# EAGLE design duinolpcfwhspi (EAGLE 7.2.0)
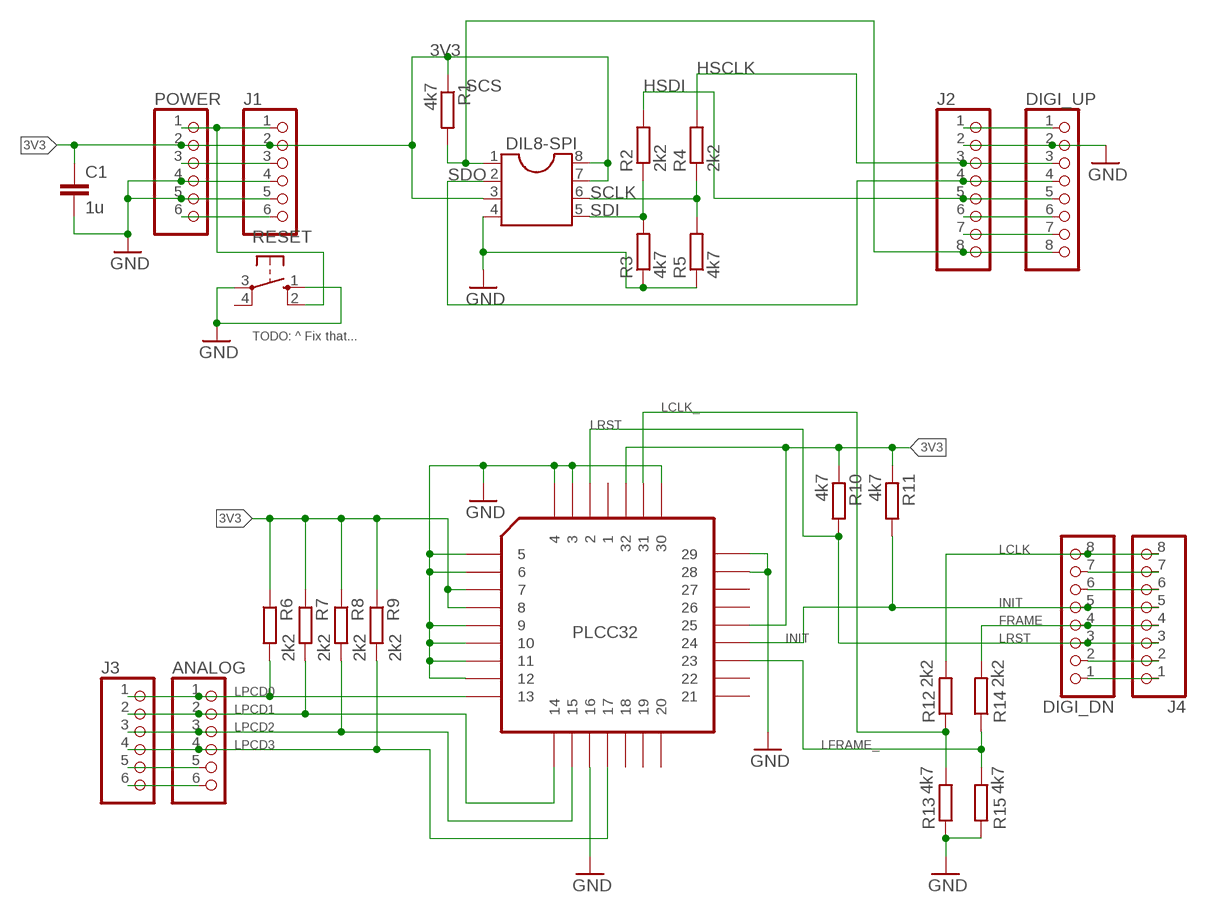
[diagram p0: schematic, sheet 1]

## Parts
ANALOG  PINHD-1X6  [1X06]
C1  1u  C-EU025-025X050  [C025-025X050]
DIGI_DN  PINHD-1X8TH  [1X08-TH]
DIGI_UP  PINHD-1X8TH  [1X08-TH]
DIL8-SPI  DIL8  [DIL08]
J1  PINHD-1X6  [1X06]
J2  PINHD-1X8TH  [1X08-TH]
J3  PINHD-1X6  [1X06]
J4  PINHD-1X8TH  [1X08-TH]
PLCC32  PLCC32  [PLCC-S32]
POWER  PINHD-1X6  [1X06]
R1  4k7  R-EU_0207/2V  [0207/2V]
R2  2k2  R-EU_0207/2V  [0207/2V]
R3  4k7  R-EU_0207/2V  [0207/2V]
R4  2k2  R-EU_0207/2V  [0207/2V]
R5  4k7  R-EU_0207/2V  [0207/2V]
R6  2k2  R-EU_0207/2V  [0207/2V]
R7  2k2  R-EU_0207/2V  [0207/2V]
R8  2k2  R-EU_0207/2V  [0207/2V]
R9  2k2  R-EU_0207/2V  [0207/2V]
R10  4k7  R-EU_0207/2V  [0207/2V]
R11  4k7  R-EU_0207/2V  [0207/2V]
R12  2k2  R-EU_0207/2V  [0207/2V]
R13  4k7  R-EU_0207/2V  [0207/2V]
R14  2k2  R-EU_0207/2V  [0207/2V]
R15  4k7  R-EU_0207/2V  [0207/2V]
RESET  10-XX  [B3F-10XX]

## Nets
3V3: C1.1 DIL8-SPI.3 DIL8-SPI.7 DIL8-SPI.8 J1.2 PLCC32.7 PLCC32.8 PLCC32.25 PLCC32.32 POWER.2 R1.1 R6.1 R7.1 R8.1 R9.1 R10.1 R11.1
5V0: J1.3 POWER.3
AREF: DIGI_UP.1 J2.1
FRAME: DIGI_DN.4 J4.4 R14.2
GND: C1.2 DIGI_UP.2 DIL8-SPI.4 J1.4 J1.5 J2.2 PLCC32.3 PLCC32.4 PLCC32.5 PLCC32.6 PLCC32.9 PLCC32.10 PLCC32.11 PLCC32.12 PLCC32.16 PLCC32.28 PLCC32.29 PLCC32.30 POWER.4 POWER.5 R3.1 R5.1 R13.1 R15.1 RESET.1(S) RESET.3(P)
HSCLK: DIGI_UP.3 J2.3 R4.2
HSDI: DIGI_UP.5 J2.5 R2.2
INIT: DIGI_DN.5 J4.5 PLCC32.24 R11.2
LCLK: DIGI_DN.8 J4.8 R12.2
LCLK_: PLCC32.31 R12.1 R13.2
LFRAME_: PLCC32.23 R14.1 R15.2
LPCD0: ANALOG.1 J3.1 PLCC32.13 R6.2
LPCD1: ANALOG.2 J3.2 PLCC32.14 R7.2
LPCD2: ANALOG.3 J3.3 PLCC32.15 R8.2
LPCD3: ANALOG.4 J3.4 PLCC32.17 R9.2
LRST: DIGI_DN.3 J4.3 PLCC32.2 R10.2
PB1: DIGI_UP.7 J2.7
PB2: DIGI_UP.6 J2.6
PC4: ANALOG.5 J3.5
PC5: ANALOG.6 J3.6
PD0: DIGI_DN.1 J4.1
PD1: DIGI_DN.2 J4.2
PD5: DIGI_DN.6 J4.6
PD6: DIGI_DN.7 J4.7
RESET: J1.1 POWER.1 RESET.2(S1)
SCLK: DIL8-SPI.6 R4.1 R5.2
SCS: DIGI_UP.8 DIL8-SPI.1 J2.8 R1.2
SDI: DIL8-SPI.5 R2.1 R3.2
SDO: DIGI_UP.4 DIL8-SPI.2 J2.4
VIN: J1.6 POWER.6
Unconnected: PLCC32.1 PLCC32.18 PLCC32.19 PLCC32.20 PLCC32.21 PLCC32.22 PLCC32.26 PLCC32.27 RESET.4(P1)

## Notes on the sheet
- TODO: ^ Fix that...

## Library data of the parts
ANALOG J1 J3 POWER = pinhead:PINHD-1X6: PIN HEADER
C1 = rcl:C-EU: CAPACITOR, European symbol
DIGI_DN DIGI_UP J2 J4 = SmartPrj:PINHD-1X8: PIN HEADER
DIL8-SPI = ic-package:DIL8: Dual In Line / Socket
PLCC32 = ref-packages:PLCC32
R1-R15 = rcl:R-EU_: RESISTOR, European symbol
RESET = switch-omron:10-XX: OMRON SWITCH

## Net classes
0 default: width 0.254 mm
1 POWER: width 0.6 mm, clearance 0.254 mm

## Board
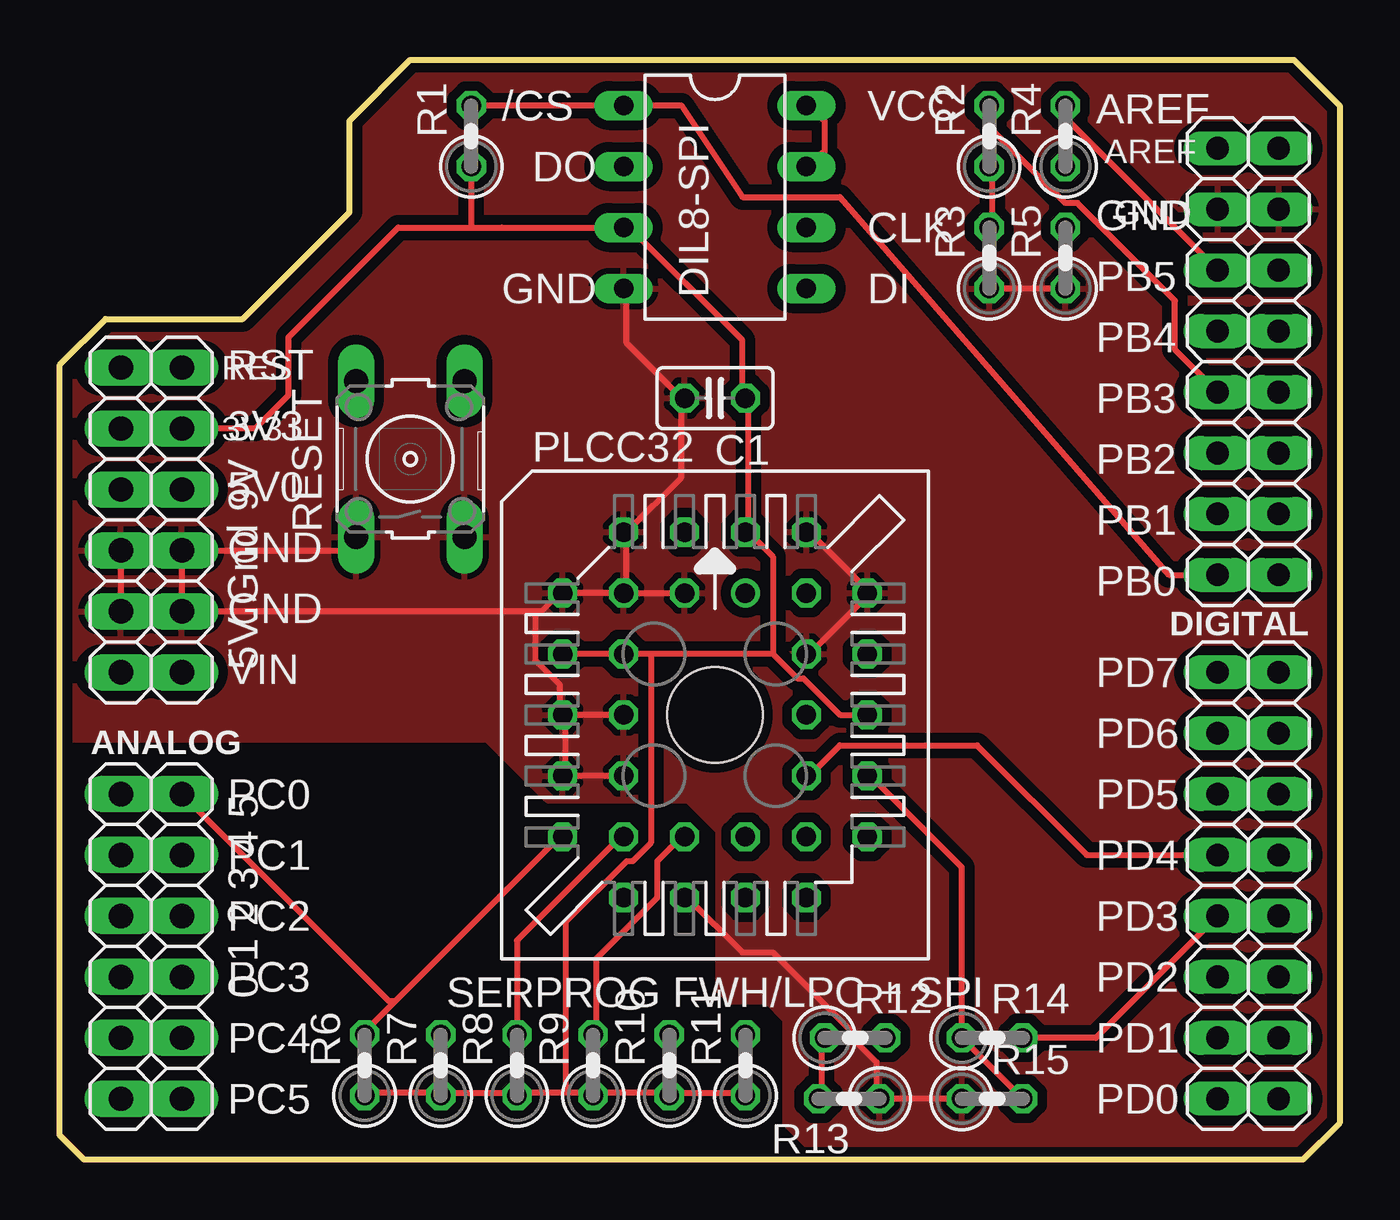
[diagram p1: board, top side]
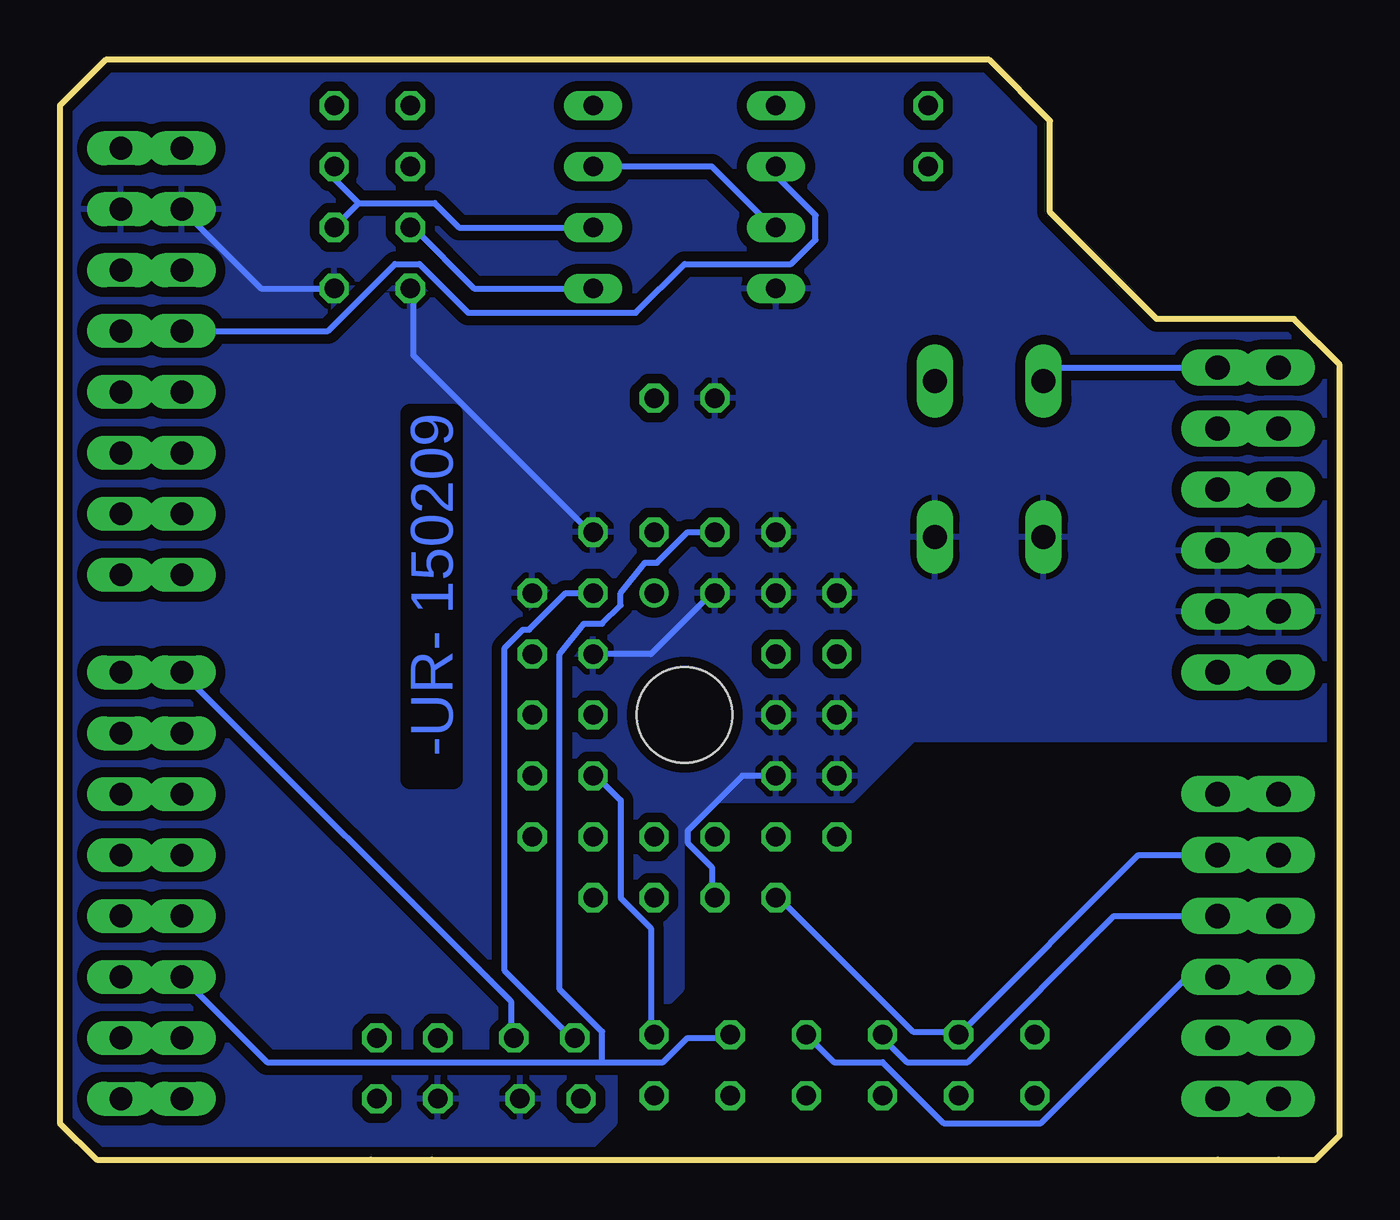
[diagram p2: board, bottom side, seen from below]

Size 53.34 x 45.85 mm. Coordinates in mm from the lower left corner, seen from the top.
Outline: 1.02,0 2.54,0 5.08,0 37.85,0 40.39,0 51.82,0 53.34,1.52 53.34,43.94 51.44,45.85 14.61,45.85 12.06,43.31 12.06,39.5 8.26,35.69 7.62,35.05 1.91,35.05 0,33.15 0,1.02
Outline: 1.02,0 1,0
Outline: 0,1 0,1.02
Outline: 0,1.02 1.02,0
Copper layers (1*16): Top 0.0356mm / dielectric 1.5011mm / Bottom 0.0356mm
Design rules "oshpark *": minimum track width 6mil, minimum drill 13mil, track to track 10mil, track to pad 8mil, pad to pad 8mil, via to via 8mil, smd to smd 6mil, copper to edge 15mil, drill to drill 6mil, minimum pad ring 7mil, minimum via ring 7mil, stop-mask expansion 3mil, vias tented up to drill 0mil, thermal gap 10mil
Holes 4 mm at 27.3,18.54

### Footprints (pad centres in the part's own frame; a part is rotated, then mirrored left to right if it is on the bottom)
1X06 = drill 1.016 long: 1 -6.35,0; 2 -3.81,0; 3 -1.27,0; 4 1.27,0; 5 3.81,0; 6 6.35,0
C025-025X050 = drill 0.813 octagon: 1 -1.27,0; 2 1.27,0
1X08-TH = drill 0.95 pad 1.422 long: 1 -8.89,0; 2 -6.35,0; 3 -3.81,0; 4 -1.27,0; 5 1.27,0; 6 3.81,0; 7 6.35,0; 8 8.89,0
DIL08 = drill 0.813 long: 1 -3.81,-3.81; 2 -1.27,-3.81; 3 1.27,-3.81; 4 3.81,-3.81; 5 3.81,3.81; 6 1.27,3.81; 7 -1.27,3.81; 8 -3.81,3.81
PLCC-S32 = drill 0.813: 1 1.27,5.08 | drill 0.813 octagon: 2 -1.27,7.62; 3 -1.27,5.08; 4 -3.81,7.62; 5 -6.35,5.08; 6 -3.81,5.08; 7 -6.35,2.54; 8 -3.81,2.54; 9 -6.35,0; 10 -3.81,0; 11 -6.35,-2.54; 12 -3.81,-2.54; 13 -6.35,-5.08; 14 -3.81,-7.62; 15 -3.81,-5.08; 16 -1.27,-7.62; 17 -1.27,-5.08; 18 1.27,-7.62; 19 1.27,-5.08; 20 3.81,-7.62; 21 6.35,-5.08; 22 3.81,-5.08; 23 6.35,-2.54; 24 3.81,-2.54; 25 6.35,0; 26 3.81,0; 27 6.35,2.54; 28 3.81,2.54; 29 6.35,5.08; 30 3.81,7.62; 31 3.81,5.08; 32 1.27,7.62
0207/2V = drill 0.813 octagon: 1 -1.27,0; 2 1.27,0
B3F-10XX = drill 1.016 long: 1 -3.251,2.261; 2 3.251,2.261; 3 -3.251,-2.261; 4 3.251,-2.261

### Placement (x,y rotation side)
ANALOG  2.54,8.89 270 top
C1  27.3,31.75 180 top
DIGI_DN  50.8,11.43 90 top
DIGI_UP  50.8,33.27 270 top
DIL8-SPI  27.3,40.13 270 top
J1  5.08,26.67 270 top
J2  48.26,33.27 270 top
J3  5.08,8.89 270 top
J4  48.26,11.43 90 top
PLCC32  27.3,18.54 0 top
POWER  2.54,26.67 270 top
R1  17.14,42.67 90 top
R2  38.73,42.67 90 top
R3  38.73,37.59 90 top
R4  41.91,42.67 90 top
R5  41.91,37.59 90 top
R6  12.7,3.94 90 top
R7  15.88,3.94 90 top
R8  19.05,3.94 90 top
R9  22.23,3.94 90 top
R10  25.4,3.94 90 top
R11  28.57,3.94 90 top
R12  33.15,5.08 0 top
R13  32.89,2.54 180 top
R14  38.86,5.08 0 top
R15  38.86,2.54 0 top
RESET  14.61,29.21 90 top

### Tracks (layer width: path | path; a pad name or v marks a point on that pad's centre or on a via)
3V3
  Top 0.254: POWER.2 J1.2 8.13,30.48 9.53,31.88 9.53,34.29 14.1,38.86 17.14,38.86 | DIL8-SPI.7 31.88,42.04 31.88,43.31 DIL8-SPI.8 | R6.1 12.7,2.79 15.75,2.79 R7.1 16,2.79 19.05,2.79 | 19.05,2.79 R8.1 19.05,2.79 | 25.4,2.79 22.35,2.79 R9.1 22.1,2.79 21.08,2.79 | 25.4,2.79 R10.1 25.4,2.79 | 25.4,2.79 28.45,2.79 R11.1 | 21.08,2.79 19.05,2.79 | PLCC32.7 21.08,21.08 23.37,21.08 PLCC32.8 23.62,21.08 24.64,21.08 | 29.72,21.08 30.73,20.07 30.99,20.07 32.51,18.54 33.53,18.54 PLCC32.25 | 29.72,21.08 29.72,25.15 28.7,26.16 | 28.7,26.16 PLCC32.32 28.7,26.16 | 28.7,26.16 28.7,31.75 C1.1 28.45,31.75 28.45,34.16 23.62,38.99 23.62,38.86 DIL8-SPI.3 23.37,38.86 18.41,38.86 17.14,38.86 | 29.72,21.08 24.64,21.08 | 21.08,2.79 21.08,9.91 23.62,12.45 23.88,12.45 24.64,13.21 24.64,21.08 | R1.1 17.14,38.86
  Bottom 0.254: DIL8-SPI.7 30.99,41.4 26.16,41.4 23.62,38.86 DIL8-SPI.3
5V0
  Top 0.254: J1.3 POWER.3
AREF
  Top 0.254: J2.1 DIGI_UP.1
FRAME
  Top 0.254: R14.2 43.18,5.08 J4.4 DIGI_DN.4
GND
  Top 0.254: R15.1 34.29,2.54 R13.1 34.04,2.54 34.04,4.06 33.02,5.08 33.02,5.33 29.72,8.64 28.45,8.64 26.16,10.92 PLCC32.16 | 21.08,18.54 23.37,18.54 PLCC32.10 | 21.08,18.54 PLCC32.9 | 21.08,16 23.37,16 PLCC32.12 | 21.08,16 PLCC32.11 21.08,16 | 21.08,16 21.08,18.54 | 21.08,18.54 PLCC32.9 | R5.1 38.86,36.32 R3.1 | DIGI_UP.2 J2.2 | 33.78,23.62 31.24,21.08 PLCC32.28 | 33.78,23.62 PLCC32.29 33.78,23.62 | 33.78,23.62 31.24,26.16 PLCC32.30 | 25.91,31.75 23.62,34.04 23.62,36.32 DIL8-SPI.4 | 25.91,31.75 C1.2 25.91,31.75 | J1.5 POWER.5 POWER.4 J1.4 | PLCC32.6 23.37,23.62 21.08,23.62 PLCC32.5 20.83,23.62 20.07,22.86 19.81,22.86 | 23.62,23.62 23.62,26.16 | 23.62,26.16 PLCC32.4 23.62,26.16 | 23.62,23.62 PLCC32.6 | 23.62,23.62 25.91,23.62 PLCC32.3 | 23.62,23.62 PLCC32.6 | 19.81,22.86 J1.5 | 25.91,31.75 25.91,28.45 23.62,26.16 | 19.81,22.86 19.81,20.83 20.83,19.81 20.83,18.54 PLCC32.9 | J1.4 11.79,25.4 RESET.1 | J1.4 J1.5
  Bottom 0.254: PLCC32.16 26.16,10.92 26.16,12.19 27.18,13.21 27.18,13.72 24.89,16 23.62,16 PLCC32.12 | R5.1 44.96,36.32 J2.2 | PLCC32.28 30.99,21.08 28.7,21.08 26.16,23.62 PLCC32.3 | R3.1 38.61,36.32 38.61,33.53 31.24,26.16 PLCC32.30
  pour Bottom (isolate 0.406): 0,17.53 17.78,17.53 20.32,14.99 26.16,14.99 27.43,13.72 27.43,7.11 27.94,6.6 29.46,6.6 30.23,5.84 30.23,1.52 31.75,0 51.82,0 53.34,1.52 53.34,43.94 51.31,45.97 14.73,45.97 12.19,43.43 12.19,39.37 7.87,35.05 1.78,35.05 0,33.27
  pour Top (isolate 0.406): 0,17.53 17.78,17.53 20.32,14.99 26.16,14.99 27.43,13.72 27.43,7.11 27.94,6.6 29.46,6.6 30.23,5.84 30.23,1.52 31.75,0 51.56,0 53.34,1.78 53.34,43.94 51.31,45.97 14.73,45.97 12.19,43.43 12.19,39.37 7.87,35.05 1.78,35.05 0,33.27
HSCLK
  Top 0.254: R4.2 41.91,43.43 J2.3 DIGI_UP.3
HSDI
  Top 0.254: R2.2 38.86,43.94 38.86,42.93 41.91,39.88 42.42,39.88 46.48,35.81 46.48,33.78 J2.5 DIGI_UP.5
INIT
  Top 0.254: DIGI_DN.5 J4.5 42.8,12.7 38.23,17.27 32.51,17.27 31.24,16 PLCC32.24
  Bottom 0.254: R11.2 28.7,5.33 28.7,9.65 29.97,10.92 29.97,14.99 30.99,16 PLCC32.24
LCLK
  Top 0.254: J4.8 DIGI_DN.8
  Bottom 0.254: J4.8 34.54,6.6 34.54,5.08 R12.2
LCLK_
  Top 0.254: R13.2 31.75,2.54 31.75,5.08 R12.1
  Bottom 0.254: PLCC32.31 31.24,23.62 32.26,23.62 33.78,22.1 34.04,22.1 34.8,21.34 34.8,7.87 32,5.08 R12.1
LFRAME_
  Top 0.254: R15.2 R14.1 37.59,12.19 33.78,16 PLCC32.23
LPCD0
  Top 0.254: ANALOG.1 J3.1 13.72,6.6 13.97,6.6 | 13.97,6.6 20.83,13.46 PLCC32.13 | 13.97,6.6 12.7,5.33 R6.2
LPCD1
  Top 0.254: J3.2 ANALOG.2
  Bottom 0.254: PLCC32.14 23.37,10.92 17.78,5.33 16,5.33 R7.2 15.75,5.33 8.38,12.7 J3.2
LPCD2
  Top 0.254: J3.3 ANALOG.3 | R8.2 19.05,5.33 19.05,9.14 23.37,13.46 PLCC32.15
  Bottom 0.254: J3.3 9.4,10.16 15.49,4.06 18.03,4.06 19.05,5.08 R8.2
LPCD3
  Top 0.254: J3.4 ANALOG.4 | R9.2 22.35,5.33 22.35,8.38 24.89,10.92 24.89,12.45 25.91,13.46 PLCC32.17
  Bottom 0.254: J3.4 6.35,7.62 12.45,1.52 16.51,1.52 19.05,4.06 21.08,4.06 22.1,5.08 R9.2
LRST
  Top 0.254: J4.3 DIGI_DN.3
  Bottom 0.254: 30.73,4.06 44.7,4.06 J4.3 | 30.73,4.06 28.19,4.06 27.18,5.08 25.4,5.08 R10.2 | 30.73,4.06 30.73,5.33 32.51,7.11 32.51,21.08 31.5,22.35 30.73,22.35 29.97,23.11 29.97,23.62 28.96,24.89 28.45,24.89 27.18,26.16 26.16,26.16 PLCC32.2
PB1
  Top 0.254: DIGI_UP.7 J2.7
PB2
  Top 0.254: DIGI_UP.6 J2.6
PC4
  Top 0.254: J3.5 ANALOG.5
PC5
  Top 0.254: J3.6 ANALOG.6
PD0
  Top 0.254: DIGI_DN.1 J4.1
PD1
  Top 0.254: DIGI_DN.2 J4.2
PD5
  Top 0.254: DIGI_DN.6 J4.6
PD6
  Top 0.254: DIGI_DN.7 J4.7
RESET
  Top 0.254: J1.1 POWER.1
  Bottom 0.254: RESET.2 11.79,33.02 J1.1
SCLK
  Bottom 0.254: 40.89,39.88 37.72,39.88 36.7,38.86 31.24,38.86 DIL8-SPI.6 | R5.2 40.89,39.88 | R4.1 41.91,40.89 40.89,39.88
SCS
  Top 0.254: DIGI_UP.8 J2.8 46.23,24.38 32.51,40.13 28.45,40.13 25.91,43.94 DIL8-SPI.1 23.37,43.94 R1.2
SDI
  Top 0.254: R2.1 38.86,41.4 38.86,38.86 R3.2
  Bottom 0.254: DIL8-SPI.5 31.24,36.32 36.07,36.32 38.61,38.86 R3.2
SDO
  Top 0.254: J2.4 DIGI_UP.4
  Bottom 0.254: J2.4 42.16,34.54 39.37,37.34 38.35,37.34 36.32,35.31 29.34,35.31 27.3,37.34 22.86,37.34 21.84,38.35 21.84,39.37 23.37,40.89 23.37,41.4 DIL8-SPI.2
VIN
  Top 0.254: J1.6 POWER.6

### Text on the board
Bottom: -UR- 150209
tPlace: /CS | VCC | AREF | DO | GND | CLK | GND | DI | PB5 | PB4 | RST | PB3 | 3V3 | PB2 | 5V0 | PB1 | GND | PB0 | GND | VIN | PD7 | PD6 | PC0 | PD5 | PC1 | PD4 | PC2 | PD3 | PC3 | PD2 | SERPROG FWH/LPC + SPI | PC4 | PD1 | PC5 | PD0
tNames: AREF | GND | RES | 3V3 | 5V Gnd 9V | DIGITAL | 0 1 2 3 4 5